# EAGLE design TurntableStrobe (EAGLE 6.4)
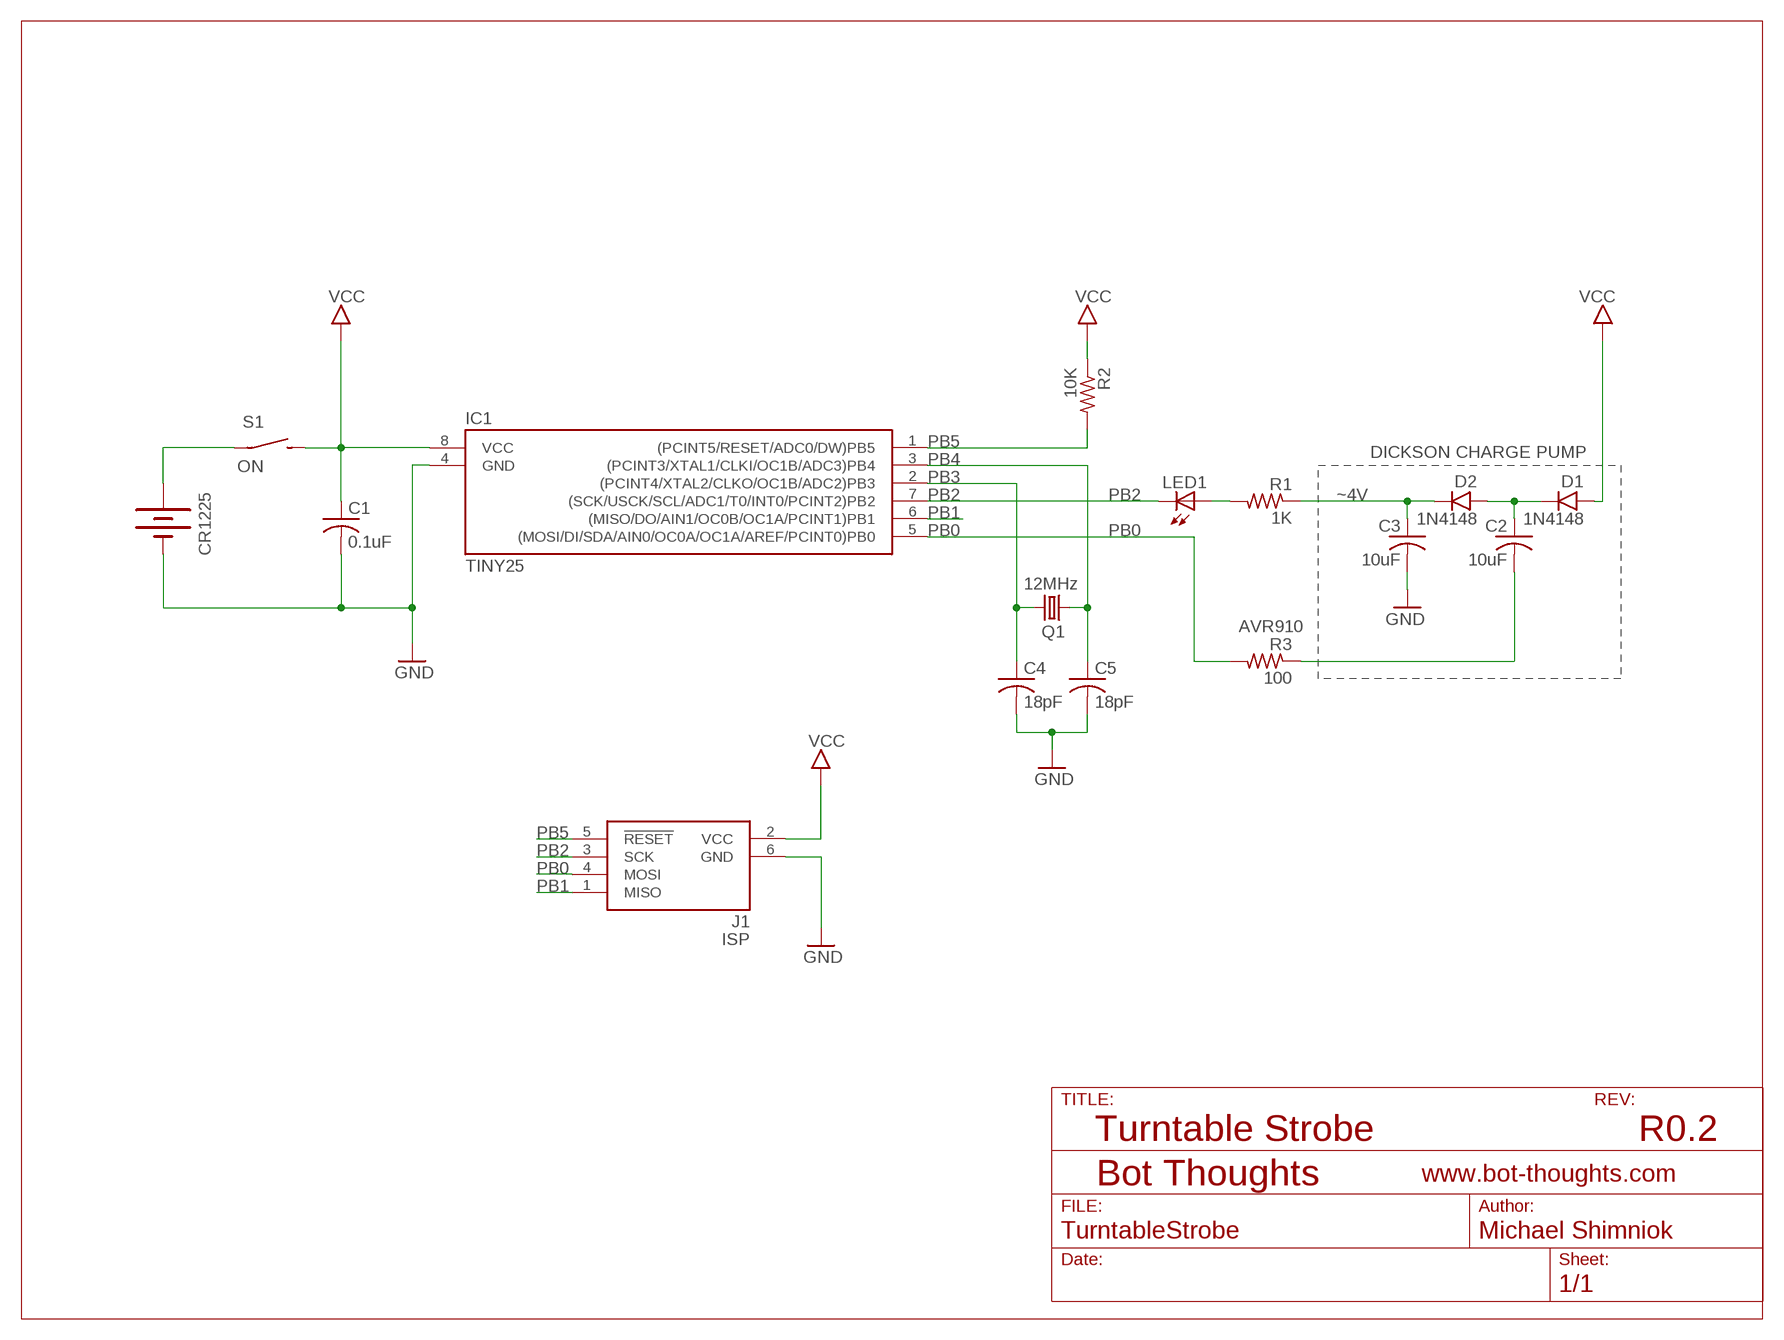
[diagram p0: schematic, sheet 1]

## Parts
C1  0.1uF  C-USC0603  [C0603]
C2  10uF  C-USC0603  [C0603]
C3  10uF  C-USC0603  [C0603]
C4  18pF  C-USC0603  [C0603]
C5  18pF  C-USC0603  [C0603]
CR1225  BATTERY12PTH  [BATTCON_12MM_PTH]
D1  1N4148  DIODE_SOD323  [SOD-323]
D2  1N4148  DIODE_SOD323  [SOD-323]
IC1  TINY25  TINY25/45/85-20SSU  [SOIC8N]
J1  ISP  AVRISP6_TP  [2X3_TP]
LED1  LED5MMRA  [LED5MMRA]
Q1  12MHz  CRYSTALNDK5X3  [NDK_2PAD_5X3]
R1  1K  R-US_R0603  [R0603]
R2  10K  R-US_R0603  [R0603]
R3  100  R-US_R0603  [R0603]
S1  ON  SPST_TAC_RECT1  [6MMTACTILE_RECT]

## Nets
GND: C1.2 C3.2 C4.2 C5.2 CR1225.GND(-) IC1.4(GND) J1.6(GND)
N$2: C2.1 D1.C D2.A
N$3: LED1.A R1.2
N$4: C2.2 R3.1
PB0: IC1.5((MOSI/DI/SDA/AIN0/OC0A/OC1A/AREF/PCINT0)PB0) J1.4(MOSI) R3.2
PB1: IC1.6((MISO/DO/AIN1/OC0B/OC1A/PCINT1)PB1) J1.1(MISO)
PB2: IC1.7((SCK/USCK/SCL/ADC1/T0/INT0/PCINT2)PB2) J1.3(SCK) LED1.C
PB3: C4.1 IC1.2((PCINT4/XTAL2/CLKO/OC1B/ADC2)PB3) Q1.P$2
PB4: C5.1 IC1.3((PCINT3/XTAL1/CLKI/OC1B/ADC3)PB4) Q1.P$1
PB5: IC1.1((PCINT5/RESET/ADC0/DW)PB5) J1.5(!RESET) R2.2
VBAT: CR1225.VCC@1(+) S1.P$1(P)
VCC: C1.1 D1.A IC1.8(VCC) J1.2(VCC) R2.1 S1.P$2(S)
VHI: C3.1 D2.C R1.1

## Notes on the sheet
- DICKSON CHARGE PUMP
- ~4V
- AVR910
- Turntable Strobe | R0.2

## Library data of the parts
C1-C5 = rcl:C-US: CAPACITOR, American symbol
CR1225 = SparkFun:BATTERY: Battery Holders Various common sizes : AA, AAA, 20mm coin cell and 12mm coin cell.
D1 D2 = bt_diode:DIODE: Diode Collection of generic diodes in various packages
IC1 = bt_avr:TINY25/45/85: Atmel AVR ATiny25,45,85 8-bit Microcontroller
J1 = bt_avr:AVRISP6: 6-pin dual-row connector for Atmel AVRISP programmer interface
LED1 = bt_opto:LED: LED Various packages
Q1 = bt_crystal:CRYSTAL: CRYSTAL
R1-R3 = rcl:R-US_: RESISTOR, American symbol
S1 = bt_electromech:SPST: SPST SWITCH

## Board
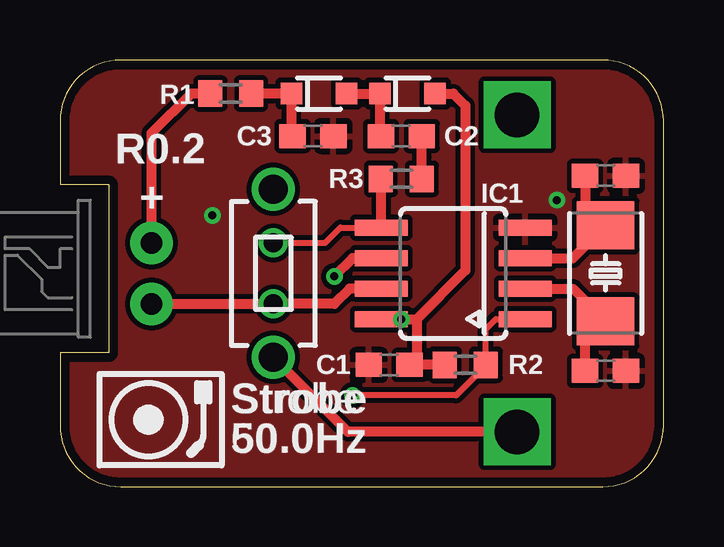
[diagram p1: board, top side]
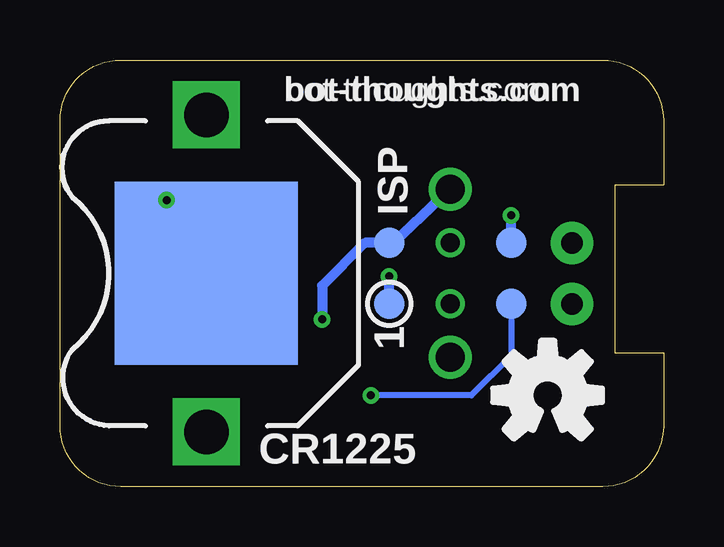
[diagram p2: board, bottom side, seen from below]

Size 25.15 x 17.78 mm. Coordinates in mm from the lower left corner, seen from the top.
Outline: 25.15,2.54 25.15,15.24 arc90 22.61,17.78 2.54,17.78 arc90 0,15.24 0,12.57 2.03,12.57 2.03,5.59 0,5.59 0,2.54 arc90 2.54,0 22.61,0 arc90 25.15,2.54
Copper layers (1*16): Top 0.0356mm / dielectric 1.5011mm / Bottom 0.0356mm
Design rules "default *": minimum track width 6mil, minimum drill 13mil, track to track 6mil, track to pad 6mil, pad to pad 6mil, via to via 6mil, smd to smd 6mil, copper to edge 15mil, drill to drill 6mil, minimum pad ring 7mil, minimum via ring 7mil, stop-mask expansion 4mil, vias tented up to drill 20mil, thermal gap 10mil

### Footprints (pad centres in the part's own frame; a part is rotated, then mirrored left to right if it is on the bottom)
C0603 = smd 1.1 x 1: 1 -0.85,0; 2 0.85,0
BATTCON_12MM_PTH = smd 7.62 x 7.62: GND 0,0 | drill 1.854 square: VCC@1 -6.604,0; VCC@2 6.604,0
SOD-323 = smd 0.9 x 0.9: A 1.15,0; C -1.15,0
SOIC8N = smd 0.66 x 2.2: 1 -1.905,-3; 2 -0.635,-3; 3 0.635,-3; 4 1.905,-3; 5 1.905,3; 6 0.635,3; 7 -0.635,3; 8 -1.905,3
2X3_TP = smd 1.27 x 1.27: 1 -1.27,2.54; 2 1.27,2.54; 5 -1.27,-2.54; 6 1.27,-2.54 | drill 0.8: 3 -1.27,0; 4 1.27,0
LED5MMRA = drill 0.9 pad 1.778: A 0,1.27; C 0,-1.27
NDK_2PAD_5X3 = smd 2 x 2.4: P$1 -2,0; P$2 2,0
R0603 = smd 1 x 1.1: 1 -0.85,0; 2 0.85,0
6MMTACTILE_RECT = drill 1.2: P$1 -3.5,0; P$2 3.5,0

### Placement (x,y rotation side)
C1  13.72,5.08 180 top
C2  14.22,14.61 0 top
C3  10.54,14.61 0 top
C4  22.73,4.83 0 top
C5  22.73,12.95 0 top
CR1225  19.05,8.89 90 bottom
D1  14.48,16.38 0 top
D2  10.79,16.38 0 top
IC1  16.38,8.89 90 top
J1  8.89,8.89 90 bottom
LED1  3.81,8.89 0 top
Q1  22.73,8.89 270 top
R1  7.11,16.38 180 top
R2  16.89,5.08 0 top
R3  14.22,12.83 180 top
S1  8.89,8.89 90 top

### Tracks (layer width: path | path; a pad name or v marks a point on that pad's centre or on a via)
GND  (via drill 0.33)
  Bottom 0.406: CR1225.GND 18.92,8.89 v20.7,11.94 | J1.6 v6.35,11.3
  pour Top (isolate 0.203): 2.54,0 22.61,0 arc90 25.15,2.54 25.15,15.24 arc90 22.61,17.78 2.54,17.78 arc90 0,15.24 0,2.54 arc90
N$2
  Top 0.406: D2.A D1.C 13.33,15.03 C2.1
N$3
  Top 0.406: R1.2 5.46,16.38 3.81,14.73 LED1.A
N$4
  Top 0.406: R3.1 C2.2
PB0
  Top 0.254: J1.4 11.05,10.16 11.68,10.79 IC1.5
  Top 0.406: IC1.5 13.38,12.82 R3.2
PB1  (via drill 0.33)
  Top 0.406: v11.43,8.76 12.19,9.53 IC1.6
  Bottom 0.406: J1.1 v11.43,8.76
PB2
  Top 0.406: LED1.C J1.3 11.43,7.62 12.06,8.26 IC1.7
PB3
  Top 0.406: IC1.2 21.38,8.24 Q1.P$2 21.88,6.04 C4.1
PB4
  Top 0.406: IC1.3 21.36,9.52 Q1.P$1 21.88,11.74 C5.1
PB5  (via drill 0.33)
  Top 0.254: v12.19,3.81 16.51,3.81 17.65,4.95 R2.2 17.74,6.57 18.16,6.99 IC1.1
  Bottom 0.254: J1.5 6.35,5.46 8,3.81 v12.19,3.81
VBAT
  Top 0.406: CR1225.VCC@1 11.99,2.29 S1.P$1
VCC  (via drill 0.33)
  Top 0.406: R2.1 C1.1 14.86,5.25 14.86,6.99 | IC1.8 v14.22,6.97 14.86,6.99 | 14.86,6.99 16.89,9.02 16.89,15.88 16.39,16.38 D1.A
  Bottom 0.406: S1.P$2 11.25,10.16 J1.2 12.45,10.16 14.22,8.38 v14.22,6.97
VHI
  Top 0.406: R1.1 D2.C 9.64,15.16 C3.1

### Text on the board
tNames: R0.2 | Strobe | 60.0Hz
bNames: bot-thoughts.com
tsilk: R1 | C3 | C2 | R0.2 | R3 | IC1 | + | C1 | R2 | Strobe | 50.0Hz
bsilk: bot-thoughts.com | ISP | 1 | CR1225